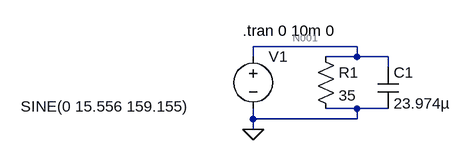
[diagram p0: schematic 1_7.asc]
1_7.asc, the LTspice schematic file:
Version 4.1
SHEET 1 880 680
WIRE 336 64 176 64
WIRE 176 80 176 64
WIRE 336 80 336 64
WIRE 336 80 288 80
WIRE 384 80 336 80
WIRE 384 96 384 80
WIRE 336 160 288 160
WIRE 384 160 336 160
WIRE 176 176 176 160
WIRE 336 176 336 160
WIRE 336 176 176 176
WIRE 176 192 176 176
FLAG 176 192 0
SYMBOL voltage 176 64 R0
WINDOW 123 0 0 Left 0
WINDOW 39 24 124 Left 2
WINDOW 3 -227 93 Center 2
SYMATTR Value SINE(0 15.556 159.155)
SYMATTR InstName V1
SYMBOL res 272 64 R0
SYMATTR InstName R1
SYMATTR Value 35
SYMBOL cap 368 96 R0
SYMATTR InstName C1
SYMATTR Value 23.974µ
TEXT 160 40 Left 2 !.tran 0 10m 0

The netlist it stands for:
* 1_7.asc
V1 N001 0 SINE(0 15.556 159.155)
R1 N001 0 35
C1 N001 0 23.974µ
.tran 0 10m 0
.backanno
.end

* Results of the author's LTspice run, read from the files saved beside the schematic
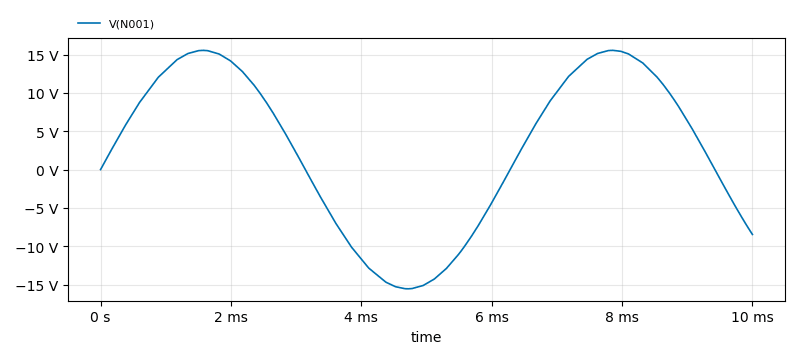
[diagram p1: Transient Analysis of 1_7.asc, plotted from the saved traces]
* Transient Analysis, 1 run:
*   V(N001): min -15.55 V, max 15.56 V, average 2.85 V, rms 10.75 V, last -8.463 V